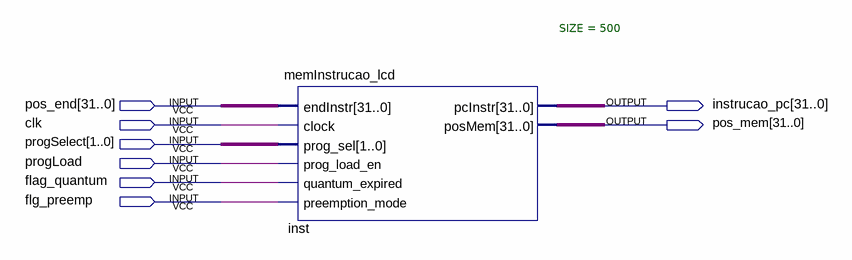
[diagram p0: schematic sheet]
// Quartus schematic teste_memInstrucoes_com_preempcao.bdf as structural Verilog: 1 symbols, 8 pins
module teste_memInstrucoes_com_preempcao (
  input  [31:0] pos_end,
  input  clk,
  input  [1:0] progSelect,
  input  progLoad,
  input  flag_quantum,
  input  flg_preemp,
  output [31:0] instrucao_pc,
  output [31:0] pos_mem
);

  memInstrucao_lcd #(.SIZE(500)) inst (
    .endInstr(pos_end), .clock(clk), .prog_sel(progSelect), .prog_load_en(progLoad),
    .quantum_expired(flag_quantum), .preemption_mode(flg_preemp), .pcInstr(instrucao_pc), .posMem(pos_mem));
endmodule
